# EAGLE design nanopi_shield (EAGLE 9.6.1)
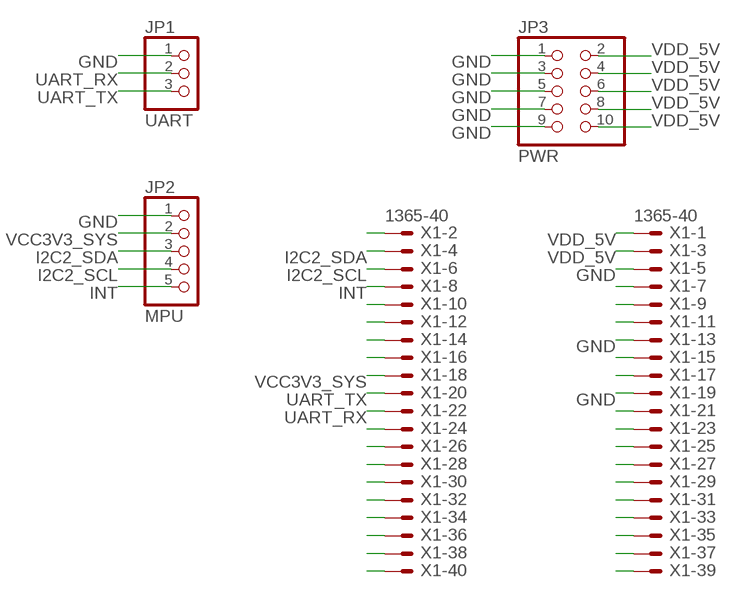
[diagram p0: schematic, sheet 1]

## Parts
JP1  UART  PINHD-1X3  [1X03]
JP2  MPU  PINHD-1X5  [1X05]
JP3  PWR  PINHD-2X5  [2X05]
X1  1365-40  [1365-40]

## Nets
GND: JP1.1 JP2.1 JP3.1 JP3.3 JP3.5 JP3.7 JP3.9 X1.5 X1.13 X1.19
I2C2_SCL: JP2.4 X1.6
I2C2_SDA: JP2.3 X1.4
INT: JP2.5 X1.8
N$2: X1.7
N$3: X1.9
N$4: X1.2
N$5: X1.14
N$6: X1.17
N$7: X1.21
N$8: X1.23
N$9: X1.10
N$23: X1.12
N$25: X1.16
N$29: X1.24
N$30: X1.26
N$31: X1.28
N$32: X1.30
N$33: X1.32
N$34: X1.34
N$35: X1.36
N$36: X1.38
N$37: X1.40
N$43: X1.11
N$45: X1.15
N$50: X1.25
N$51: X1.27
N$52: X1.29
N$53: X1.31
N$54: X1.33
N$55: X1.35
N$56: X1.37
N$57: X1.39
UART_RX: JP1.2 X1.22
UART_TX: JP1.3 X1.20
VCC3V3_SYS: JP2.2 X1.18
VDD_5V: JP3.2 JP3.4 JP3.6 JP3.8 JP3.10 X1.1 X1.3

## Library data of the parts
JP1 = pinhead:PINHD-1X3: PIN HEADER
JP2 = pinhead:PINHD-1X5: PIN HEADER
JP3 = pinhead:PINHD-2X5: PIN HEADER
X1 = con-leotronics:1365-40: DUAL ROW STRAIGHT HEADER 1364 SERIES. 1.27mm x 1.27mm. Without Fixing Post. SMT Source: http://www.leotronics.co.uk/Conexcon/Data%20Sheets/sec.%20A/1364ing.pdf; OC_FARNELL: unknown; OC_NEWARK: unknown

## Board
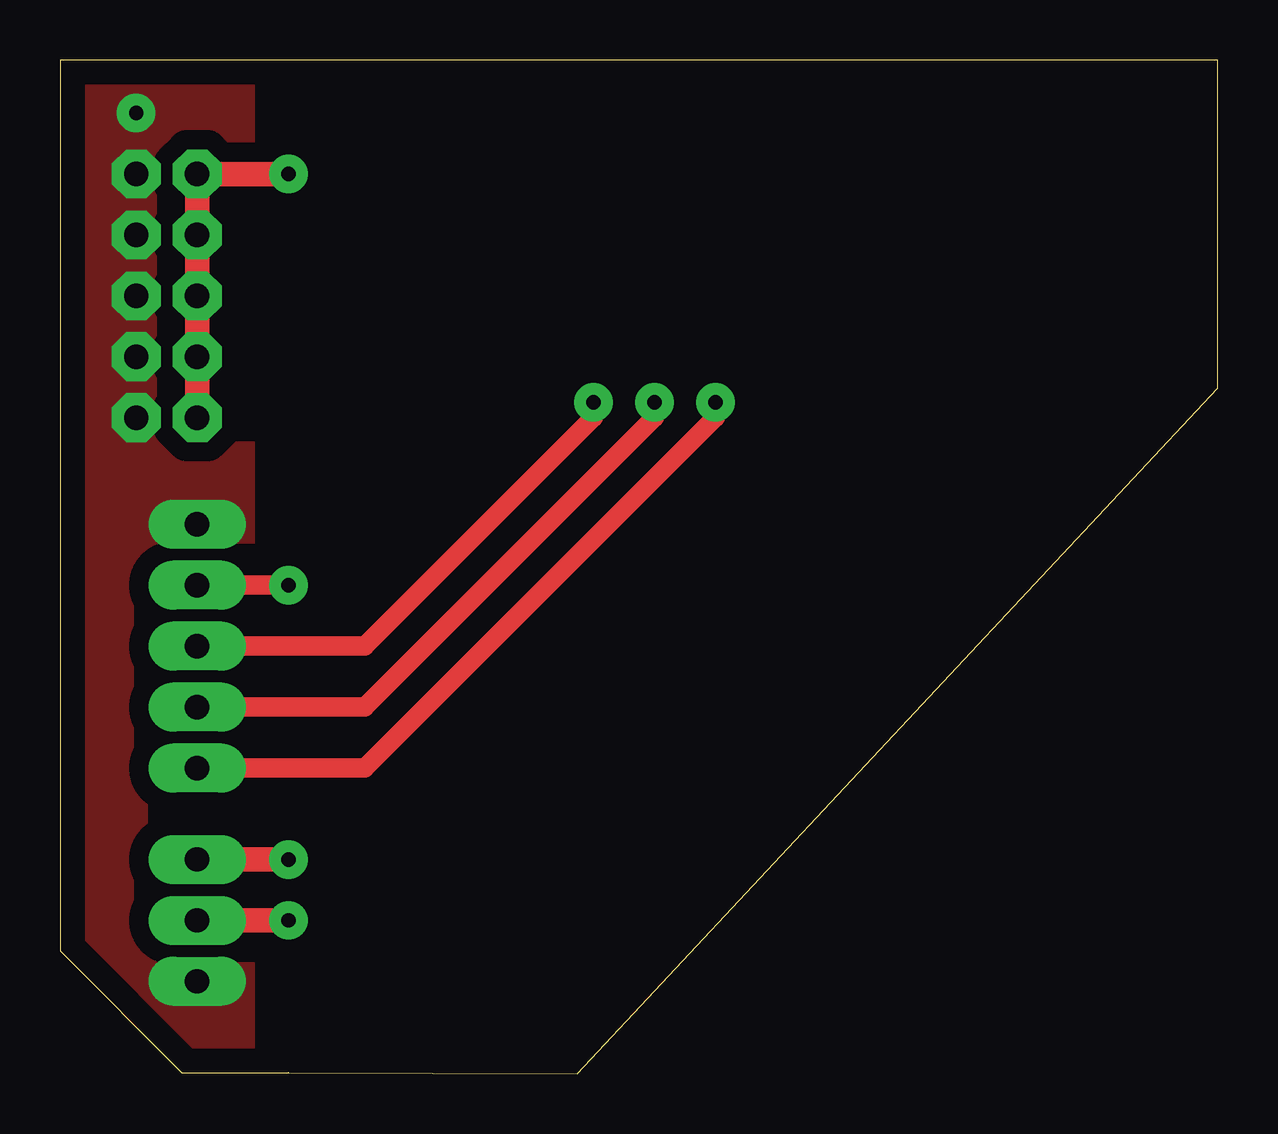
[diagram p1: board, top side]
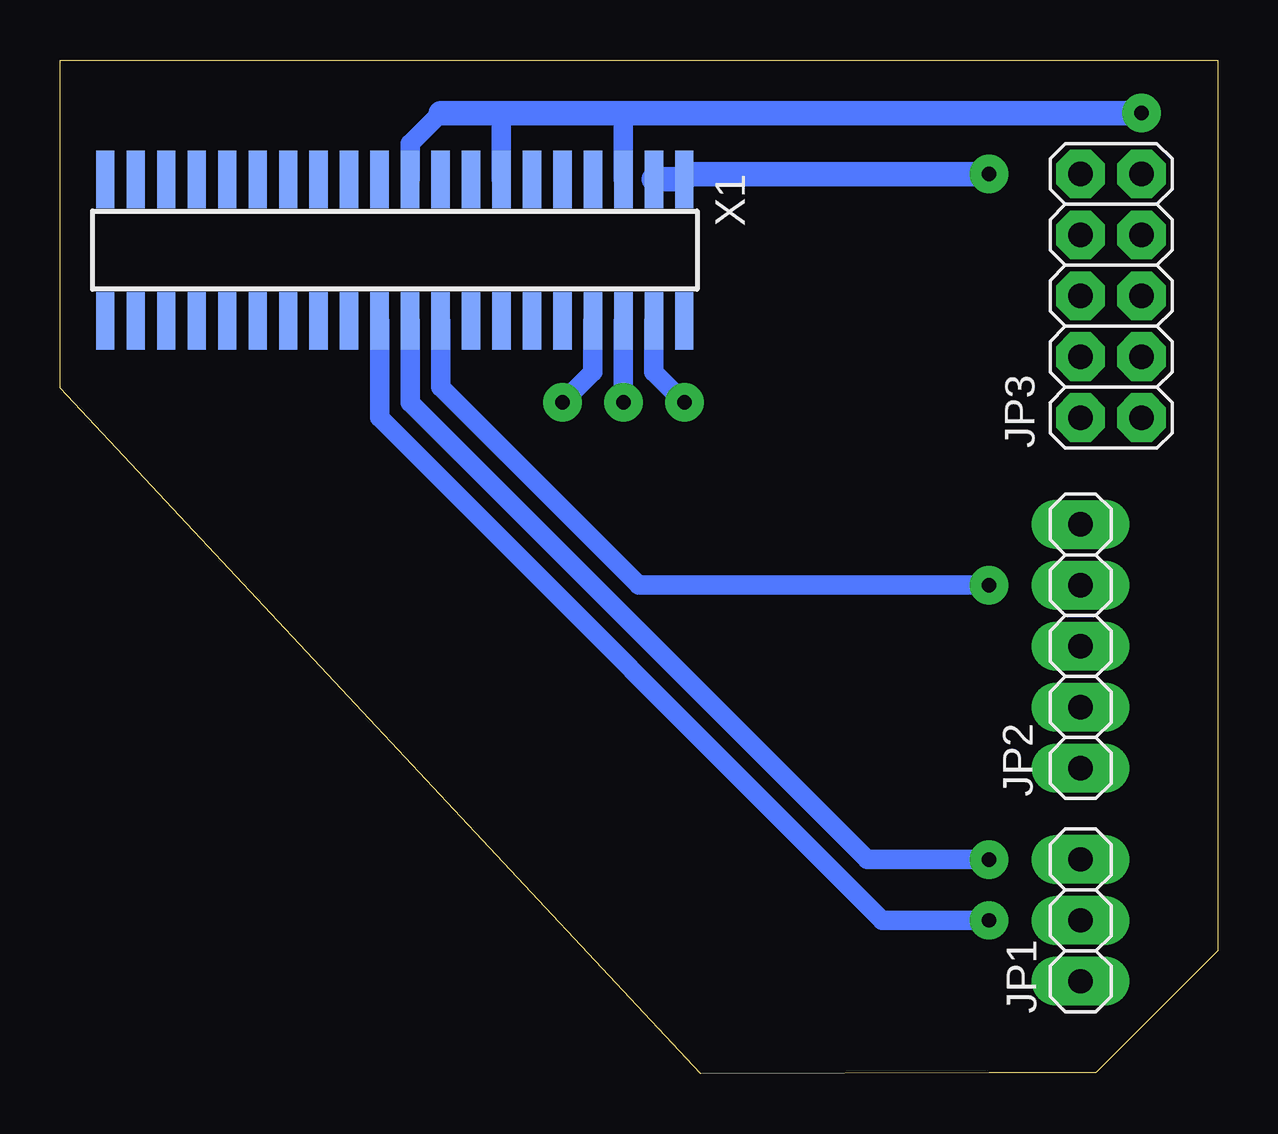
[diagram p2: board, bottom side, seen from below]

Size 48.24 x 42.26 mm. Coordinates in mm from the lower left corner, seen from the top.
Outline: 0,42.26 0,5.13 5.08,0.05 9.53,0.05 9.51,0.04 21.55,0 48.24,28.58 48.24,42.26 0,42.26
Copper layers (1*16): Top 0.035mm / dielectric 1.5mm / Bottom 0.035mm
Design rules "default *": minimum track width 12mil, minimum drill 0.35mm, track to track 6mil, track to pad 6mil, pad to pad 6mil, via to via 6mil, smd to smd 6mil, copper to edge 40mil, drill to drill 12mil, minimum pad ring 20mil, minimum via ring 8mil, stop-mask expansion 4mil, vias tented up to drill 0mil, thermal gap 10mil

### Footprints (pad centres in the part's own frame; a part is rotated, then mirrored left to right if it is on the bottom)
1X03 = drill 1.016 long: 1 -2.54,0; 2 0,0; 3 2.54,0
1X05 = drill 1.016 long: 1 -5.08,0; 2 -2.54,0; 3 0,0; 4 2.54,0; 5 5.08,0
2X05 = drill 1.016 octagon: 1 -5.08,-1.27; 2 -5.08,1.27; 3 -2.54,-1.27; 4 -2.54,1.27; 5 0,-1.27; 6 0,1.27; 7 2.54,-1.27; 8 2.54,1.27; 9 5.08,-1.27; 10 5.08,1.27
1365-40 = smd 0.76 x 2.4: 1 -12.065,-2.95; 2 -12.065,2.95; 3 -10.795,-2.95; 4 -10.795,2.95; 5 -9.525,-2.95; 6 -9.525,2.95; 7 -8.255,-2.95; 8 -8.255,2.95; 9 -6.985,-2.95; 10 -6.985,2.95; 11 -5.715,-2.95; 12 -5.715,2.95; 13 -4.445,-2.95; 14 -4.445,2.95; 15 -3.175,-2.95; 16 -3.175,2.95; 17 -1.905,-2.95; 18 -1.905,2.95; 19 -0.635,-2.95; 20 -0.635,2.95; 21 0.635,-2.95; 22 0.635,2.95; 23 1.905,-2.95; 24 1.905,2.95; 25 3.175,-2.95; 26 3.175,2.95; 27 4.445,-2.95; 28 4.445,2.95; 29 5.715,-2.95; 30 5.715,2.95; 31 6.985,-2.95; 32 6.985,2.95; 33 8.255,-2.95; 34 8.255,2.95; 35 9.525,-2.95; 36 9.525,2.95; 37 10.795,-2.95; 38 10.795,2.95; 39 12.065,-2.95; 40 12.065,2.95

### Placement (x,y rotation side)
JP1  5.71,6.4 90 bottom
JP2  5.71,17.83 270 bottom
JP3  4.45,32.43 90 bottom
X1  34.29,34.34 180 bottom

### Tracks (layer width: path | path; a pad name or v marks a point on that pad's centre or on a via)
GND  (via drill 0.6 pad 1.6)
  Bottom 0.813: 24.77,40.05 X1.5 | 29.84,40.05 X1.13 | 32.38,40.05 33.66,38.78 X1.19
  Bottom 1.016: v3.17,40.05 24.77,40.05 29.84,40.05 32.38,40.05
  pour Top (isolate 0.813, no thermals): 0.64,41.32 0.64,5.13 5.71,0.05 7.62,0.05 7.62,41.32
I2C2_SCL  (via drill 0.6 pad 1.6)
  Top 0.813: v24.77,27.99 24.77,27.35 12.7,15.29 JP2.4
  Bottom 0.813: v24.77,27.99 X1.6
I2C2_SDA  (via drill 0.6 pad 1.6)
  Top 0.813: v22.23,27.99 22.23,27.35 12.7,17.83 JP2.3
  Bottom 0.813: v22.23,27.99 23.5,29.26 X1.4
INT  (via drill 0.6 pad 1.6)
  Top 0.813: v27.3,27.99 27.3,27.35 12.7,12.75 JP2.5
  Bottom 0.813: X1.8 26.04,29.26 v27.3,27.99
UART_RX  (via drill 0.6 pad 1.6)
  Top 1.016: JP1.2 v9.53,6.4
  Bottom 0.813: v9.53,6.4 13.97,6.4 34.92,27.35 X1.22
UART_TX  (via drill 0.6 pad 1.6)
  Top 1.016: v9.53,8.94 JP1.3
  Bottom 0.813: X1.20 33.66,27.99 14.61,8.94 v9.53,8.94
VCC3V3_SYS  (via drill 0.6 pad 1.6)
  Top 0.813: v9.53,20.37 JP2.2
  Bottom 0.813: X1.18 32.38,28.62 24.13,20.37 v9.53,20.37
VDD_5V  (via drill 0.6 pad 1.6)
  Top 1.016: JP3.2 JP3.4 JP3.6 JP3.8 JP3.10 v9.53,37.51
  Bottom 1.016: v9.53,37.51 22,37.51 X1.1 X1.3